# EAGLE design V1 (EAGLE 9.3.0)
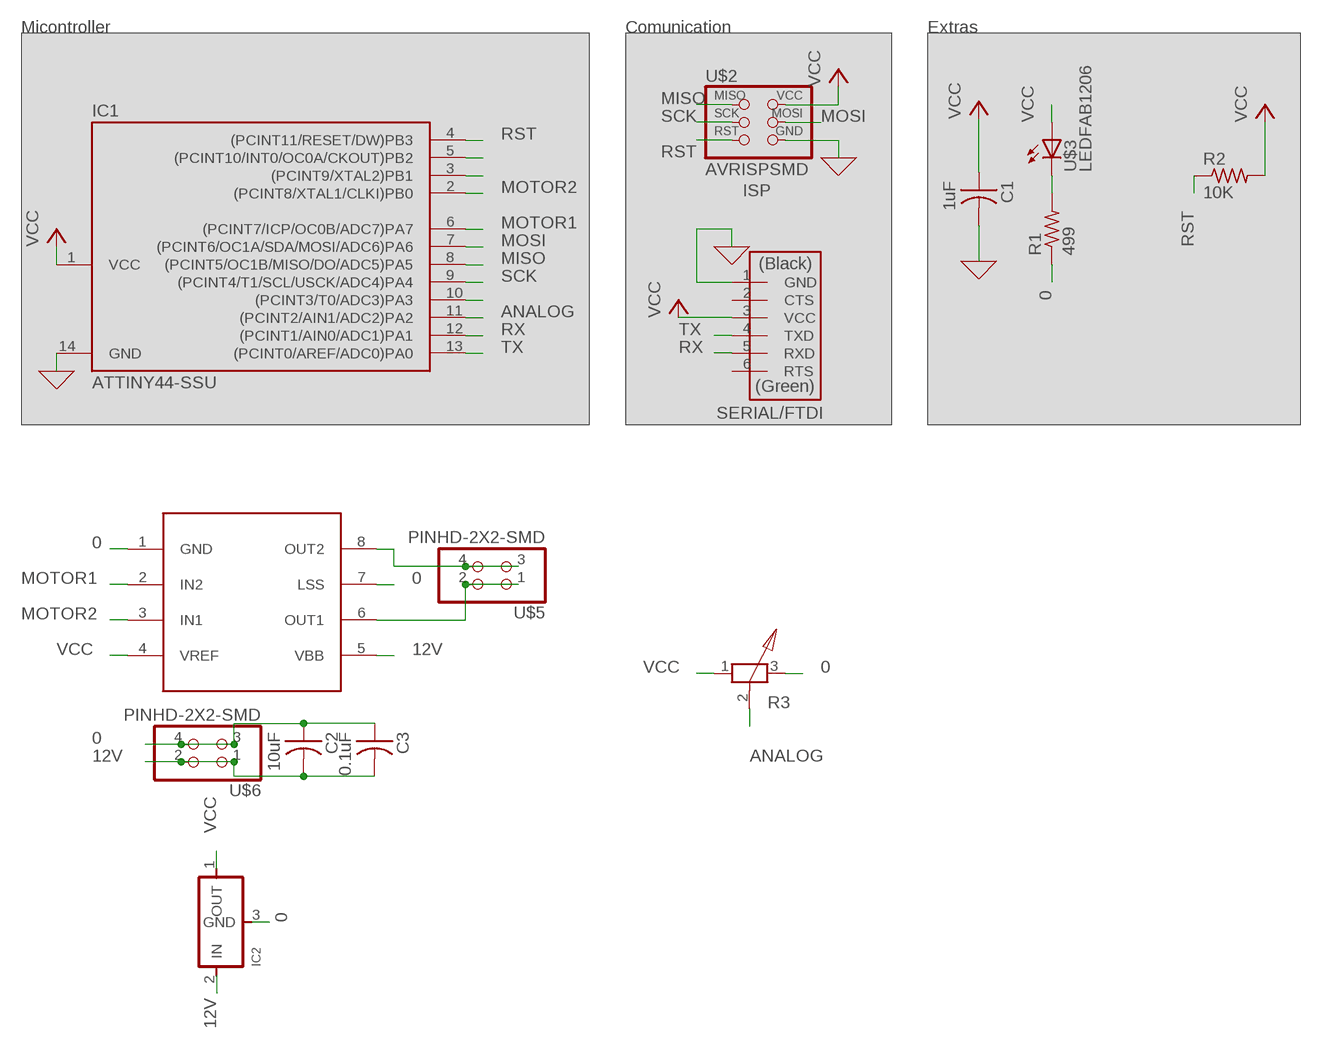
[diagram p0: schematic, sheet 1]

## Parts
C1  1uF  CAP-US1206FAB  [C1206FAB]
C2  10uF  CAP-US1206FAB  [C1206FAB]
C3  0.1uF  CAP-US1206FAB  [C1206FAB]
IC1  ATTINY44-SSU  [SOIC14]
IC2  REGULATORSOT23  [SOT23]
R1  499  RES-US1206FAB  [R1206FAB]
R2  10K  RES-US1206FAB  [R1206FAB]
R3  TRIMPOT  [SMDPOT]
U$1  FTDI-SMD-HEADER  [1X06SMD]
U$2  AVRISPSMD  [2X03SMD]
U$3  LEDFAB1206  [LED1206FAB]
U$4  A4953-H-BRIDGE-MOTOR-DRIVER  [SOIC8]
U$5  PINHD-2X2-SMD  [2X02SMD]
U$6  PINHD-2X2-SMD  [2X02SMD]

## Nets
0: C1.2 C2.1 C3.1 IC1.14(GND) IC2.3(GND) R1.1 R3.3 U$1.1(GND) U$2.6(GND) U$4.1(GND) U$4.7(LSS) U$6.3 U$6.4 ; supply symbol labelled GND
12V: C2.2 C3.2 IC2.2(IN) U$4.5(VBB) U$6.1 U$6.2
ANALOG: IC1.11((PCINT2/AIN1/ADC2)PA2) R3.2
MISO: IC1.8((PCINT5/OC1B/MISO/DO/ADC5)PA5) U$2.1(MISO)
MOSI: IC1.7((PCINT6/OC1A/SDA/MOSI/ADC6)PA6) U$2.4(MOSI)
MOTOR1: IC1.6((PCINT7/ICP/OC0B/ADC7)PA7) U$4.2(IN2)
MOTOR2: IC1.2((PCINT8/XTAL1/CLKI)PB0) U$4.3(IN1)
N$1: R1.2 U$3.2(C)
N$3: U$4.6(OUT1) U$5.1 U$5.2
N$4: U$4.8(OUT2) U$5.3 U$5.4
N$5: IC1.5((PCINT10/INT0/OC0A/CKOUT)PB2)
N$6: IC1.3((PCINT9/XTAL2)PB1)
N$12: IC1.10((PCINT3/T0/ADC3)PA3)
RST: IC1.4((PCINT11/RESET/DW)PB3) R2.1 U$2.5(RST)
RX: IC1.12((PCINT1/AIN0/ADC1)PA1) U$1.5(RXD)
SCK: IC1.9((PCINT4/T1/SCL/USCK/ADC4)PA4) U$2.3(SCK)
TX: IC1.13((PCINT0/AREF/ADC0)PA0) U$1.4(TXD)
VCC: C1.1 IC1.1(VCC) IC2.1(OUT) R2.2 R3.1 U$1.3(VCC) U$2.2(VCC) U$3.1(A) U$4.4(VREF)
Unconnected: U$1.2(CTS) U$1.6(RTS)

## Notes on the sheet
- Micontroller | Comunication | Extras
- ISP
- SERIAL/FTDI

## Library data of the parts
C1-C3 = fab:CAP-US
IC1 = fab:ATTINY44
IC2 = fab:REGULATOR
R1 R2 = fab:RES-US: Resistor (US Symbol) Variants with postfix FAB are widened to allow the routing of internal traces
R3 = my_mixed:TRIMPOT
U$1 = fab:FTDI-SMD-HEADER
U$2 = fab:AVRISP
U$3 = fab:LED: LED
U$4 = fab:A4953-H-BRIDGE-MOTOR-DRIVER
U$5 U$6 = fab:PINHD-2X2-SMD

## Board
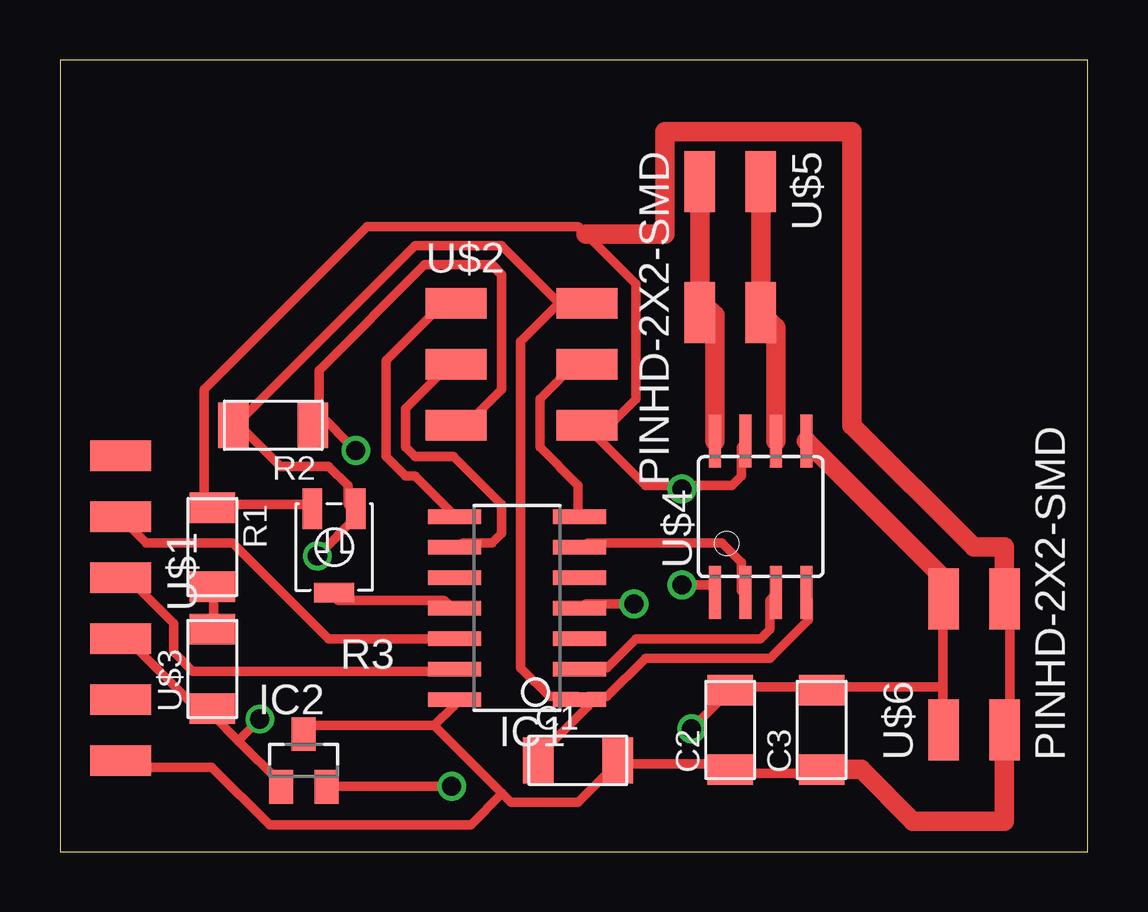
[diagram p1: board, top side]
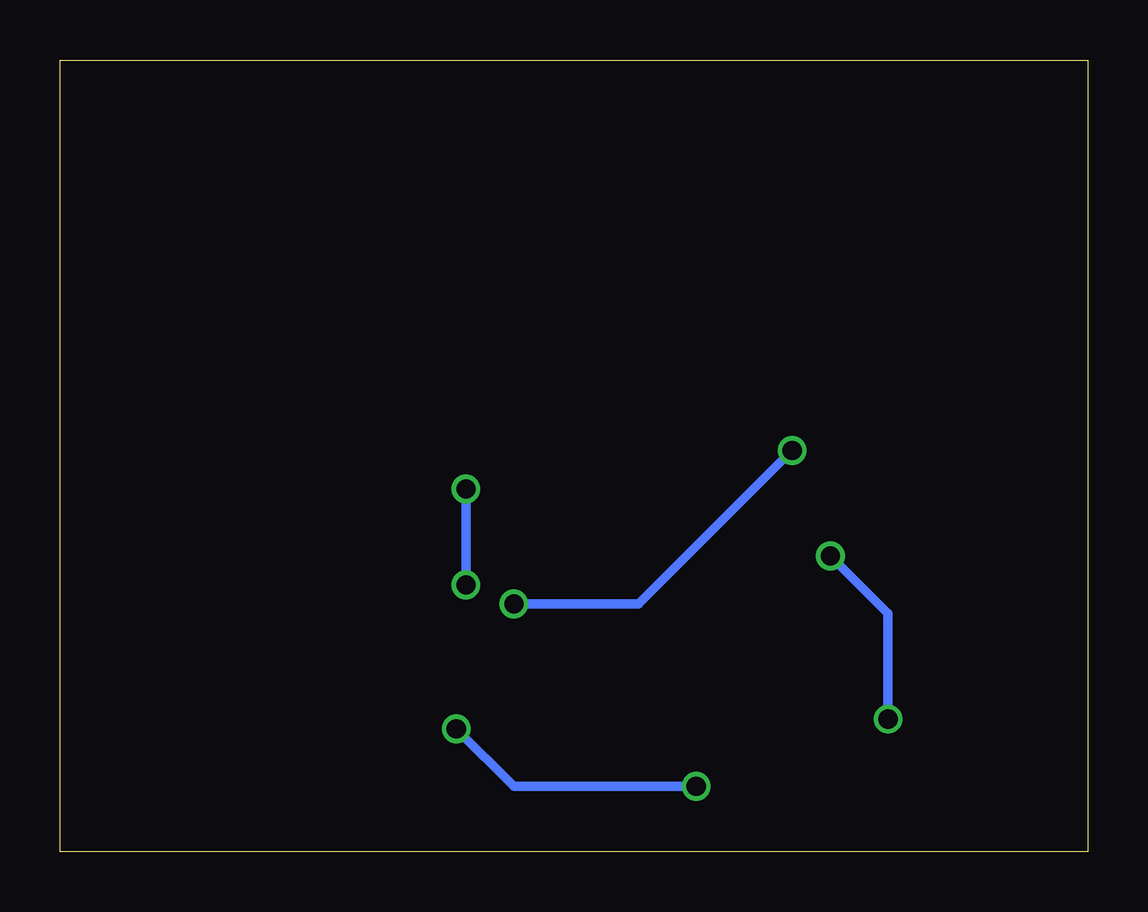
[diagram p2: board, bottom side, seen from below]

Size 42.85 x 33.01 mm. Coordinates in mm from the lower left corner, seen from the top.
Outline: 0,0 42.85,0 42.85,33.01 0,33.01 0,0
Copper layers (1*16): Top 0.035mm / dielectric 1.5mm / Bottom 0.035mm
Design rules "default *": minimum track width 0.4mm, minimum drill 31.25mil, track to track 0.4mm, track to pad 0.4mm, pad to pad 0.4mm, via to via 0.4mm, smd to smd 0.4mm, copper to edge 0.4mm, drill to drill 6mil, minimum pad ring 10mil, minimum via ring 8mil, stop-mask expansion 4mil, vias tented up to drill 0mil, thermal gap 10mil

### Footprints (pad centres in the part's own frame; a part is rotated, then mirrored left to right if it is on the bottom)
C1206FAB = smd 1.27 x 1.905: 1 -1.651,0; 2 1.651,0
SOIC14 = smd 0.61 x 2.21: 1 -3.81,-2.603; 2 -2.54,-2.603; 3 -1.27,-2.603; 4 0,-2.603; 5 1.27,-2.603; 6 2.54,-2.603; 7 3.81,-2.603; 8 3.81,2.603; 9 2.54,2.603; 10 1.27,2.603; 11 0,2.603; 12 -1.27,2.603; 13 -2.54,2.603; 14 -3.81,2.603
SOT23 = smd 1 x 1.4: 1 -0.95,-1.1; 2 0.95,-1.1; 3 0,1.1
R1206FAB = smd 1.27 x 1.905: 1 -1.651,0; 2 1.651,0
SMDPOT = smd 0.813 x 1.676: 1 -0.9,-1.6; 3 0.9,-1.6 | smd 1.676 x 0.813: 2 0,1.9
1X06SMD = smd 2.54 x 1.27: 1 0,6.35; 2 0,3.81; 3 0,1.27; 4 0,-1.27; 5 0,-3.81; 6 0,-6.35
2X03SMD = smd 2.54 x 1.27: 1 -2.54,2.54; 2 2.92,2.54; 3 -2.54,0; 4 2.92,0; 5 -2.54,-2.54; 6 2.92,-2.54
LED1206FAB = smd 1.27 x 1.905: 1 -1.651,0; 2 1.651,0
SOIC8 = smd 0.5 x 2.2: 1 -1.905,-3.154; 2 -0.645,-3.154; 3 0.625,-3.154; 4 1.895,-3.154; 5 1.905,3.154; 6 0.635,3.154; 7 -0.635,3.154; 8 -1.905,3.154
2X02SMD = smd 2.54 x 1.27: 1 -2.54,1.27; 2 2.92,1.27; 3 -2.54,-1.27; 4 2.92,-1.27

### Placement (x,y rotation side)
C1  21.59,3.81 0 top
C2  27.94,5.08 90 top
C3  31.75,5.08 90 top
IC1  19.05,10.16 90 top
IC2  10.16,3.81 0 top
R1  6.35,12.7 270 top
R2  8.89,17.78 180 top
R3  11.43,12.7 180 top
U$1  2.54,10.16 180 top
U$2  19.05,20.32 0 top
U$3  6.35,7.62 90 top
U$4  29.21,13.97 0 top
U$5  27.94,25.4 270 top
U$6  38.1,7.62 90 top

### Tracks (layer width: path | path; a pad name or v marks a point on that pad's centre or on a via)
0  (via drill 0.79)
  Top 0.4: R3.3 10.4,14.47 6.4,14.47 R1.1 6,14.47 6,19.27 12.8,26.07 21.6,26.07 21.93,25.74 24,23.67 24,18.87 22.4,17.27 | 25.93,15.27 24.4,15.27 22.4,17.27 | 25.93,15.27 28,15.27 28.4,15.67 28.4,16.87 U$4.7 | 22.4,17.27 22,17.67 U$2.6 22.4,17.27 | 15.6,5.27 10.4,5.27 IC2.3 | 15.6,5.27 16.4,6.07 IC1.14 | 39.2,4.87 U$6.3 39.6,5.27 39.6,10.47 U$6.4 39.2,10.87 | 32,3.27 C3.1 31.6,3.27 28,3.27 C2.1 27.6,3.67 23.6,3.67 C1.2 23.2,3.67 21.6,2.07 18.8,2.07 18.43,2.44 | 18.43,2.44 15.6,5.27 | v25.93,11.13 27.13,11.13 U$4.1 | v25.93,15.13 25.93,15.27 | 18.43,2.44 17.13,1.13 8.73,1.13 6.33,3.53 2.73,3.53 U$1.1
  Top 0.813: C3.1 33.4,3.43 35.56,1.27 39.37,1.27 U$6.3 | 21.93,25.74 25.23,25.74 25.23,30.02 33.02,30.02 33.02,17.78 38.1,12.7 39.37,12.7 U$6.4
  Bottom 0.4: v25.93,15.13 v25.93,11.13
12V  (via drill 0.79)
  Top 0.4: 31.2,16.87 U$4.5 | 37.2,10.87 U$6.2 36.8,10.47 36.8,6.87 | 36.8,6.87 36.8,5.27 U$6.1 | 36.8,6.87 32,6.87 C3.2 31.6,6.87 28,6.87 C2.2 v26.33,5.13 | v16.33,2.73 11.13,2.73 IC2.2
  Top 0.813: U$6.2 36.83,11.41 U$4.5
  Bottom 0.4: v16.33,2.73 23.93,2.73 v26.33,5.13
ANALOG
  Top 0.4: R3.2 11.6,10.47 16,10.47 16.4,10.07 IC1.11
MISO
  Top 0.4: IC1.8 16.4,14.07 14.8,15.67 14.4,15.67 13.6,16.47 13.6,20.47 15.6,22.47 16.4,22.47 U$2.1
MOSI
  Top 0.4: IC1.7 21.6,14.07 21.6,15.27 20,16.87 20,18.87 21.6,20.47 U$2.4
MOTOR1
  Top 0.4: U$4.2 28.4,10.87 28.4,12.07 27.6,12.87 22,12.87 IC1.6
MOTOR2
  Top 0.4: U$4.3 29.6,10.47 29.6,9.27 29.2,8.87 24,8.87 22.8,7.67 22,7.67 IC1.2
N$1
  Top 0.4: U$3.2 6.4,9.67 6.4,10.87 R1.2
N$3
  Top 0.4: 29.6,22.47 U$5.2
  Top 0.813: U$4.6 29.84,21.84 U$5.2 U$5.1
N$4
  Top 0.4: 27.2,22.07 26.8,22.47 U$5.4 26.8,22.87 26.8,27.67 U$5.3
  Top 0.813: U$4.8 27.3,22.36 26.8,22.87 | U$5.4 U$5.3
RST  (via drill 0.79)
  Top 0.4: U$2.5 16.8,17.67 18.4,19.27 18.4,24.07 18,24.47 15.2,24.47 10.8,20.07 10.8,18.07 R2.1 10.73,18.33 v12.33,16.73 | v23.93,10.33 21.93,10.33 IC1.4
  Bottom 0.4: v23.93,10.33 18.73,10.33 v12.33,16.73
RX
  Top 0.4: IC1.12 16.4,8.87 11.2,8.87 7.2,12.87 3.6,12.87 2.8,13.67 U$1.5
SCK
  Top 0.4: IC1.9 16.8,12.87 18,12.87 18.4,13.27 18.4,14.47 16.4,16.47 14.8,16.47 14.4,16.87 14.4,18.47 16.4,20.47 U$2.3
TX
  Top 0.4: IC1.13 16.33,7.53 5.53,7.53 4.73,8.33 4.73,9.53 2.73,11.53 U$1.4
VCC  (via drill 0.79)
  Top 0.4: C1.1 20,4.07 22,6.07 IC1.1 | U$4.4 31.2,10.47 31.2,9.67 29.6,8.07 24.4,8.07 22.8,6.47 22,6.47 IC1.1 | 20.8,22.87 21.6,22.87 U$2.2 20.8,22.87 | 20.8,22.87 18.4,25.27 14.8,25.27 7.6,18.07 R2.2 7.6,17.67 9.2,16.07 11.2,16.07 12,15.27 12,14.47 R3.1 12.33,13.93 v10.73,12.33 | 20.8,22.87 19.2,21.27 19.2,7.67 20.4,6.47 21.6,6.47 IC1.1 | 7.43,4.63 6.4,5.67 U$3.1 6,5.67 2.8,8.87 U$1.3 | 7.43,4.63 9.2,2.87 IC2.1 | v8.33,5.53 7.43,4.63
  Bottom 0.4: v8.33,5.53 8.33,9.93 v10.73,12.33